# EAGLE design MRCS-Morse-Code-Buzzer-Controller (EAGLE 7.7.0)
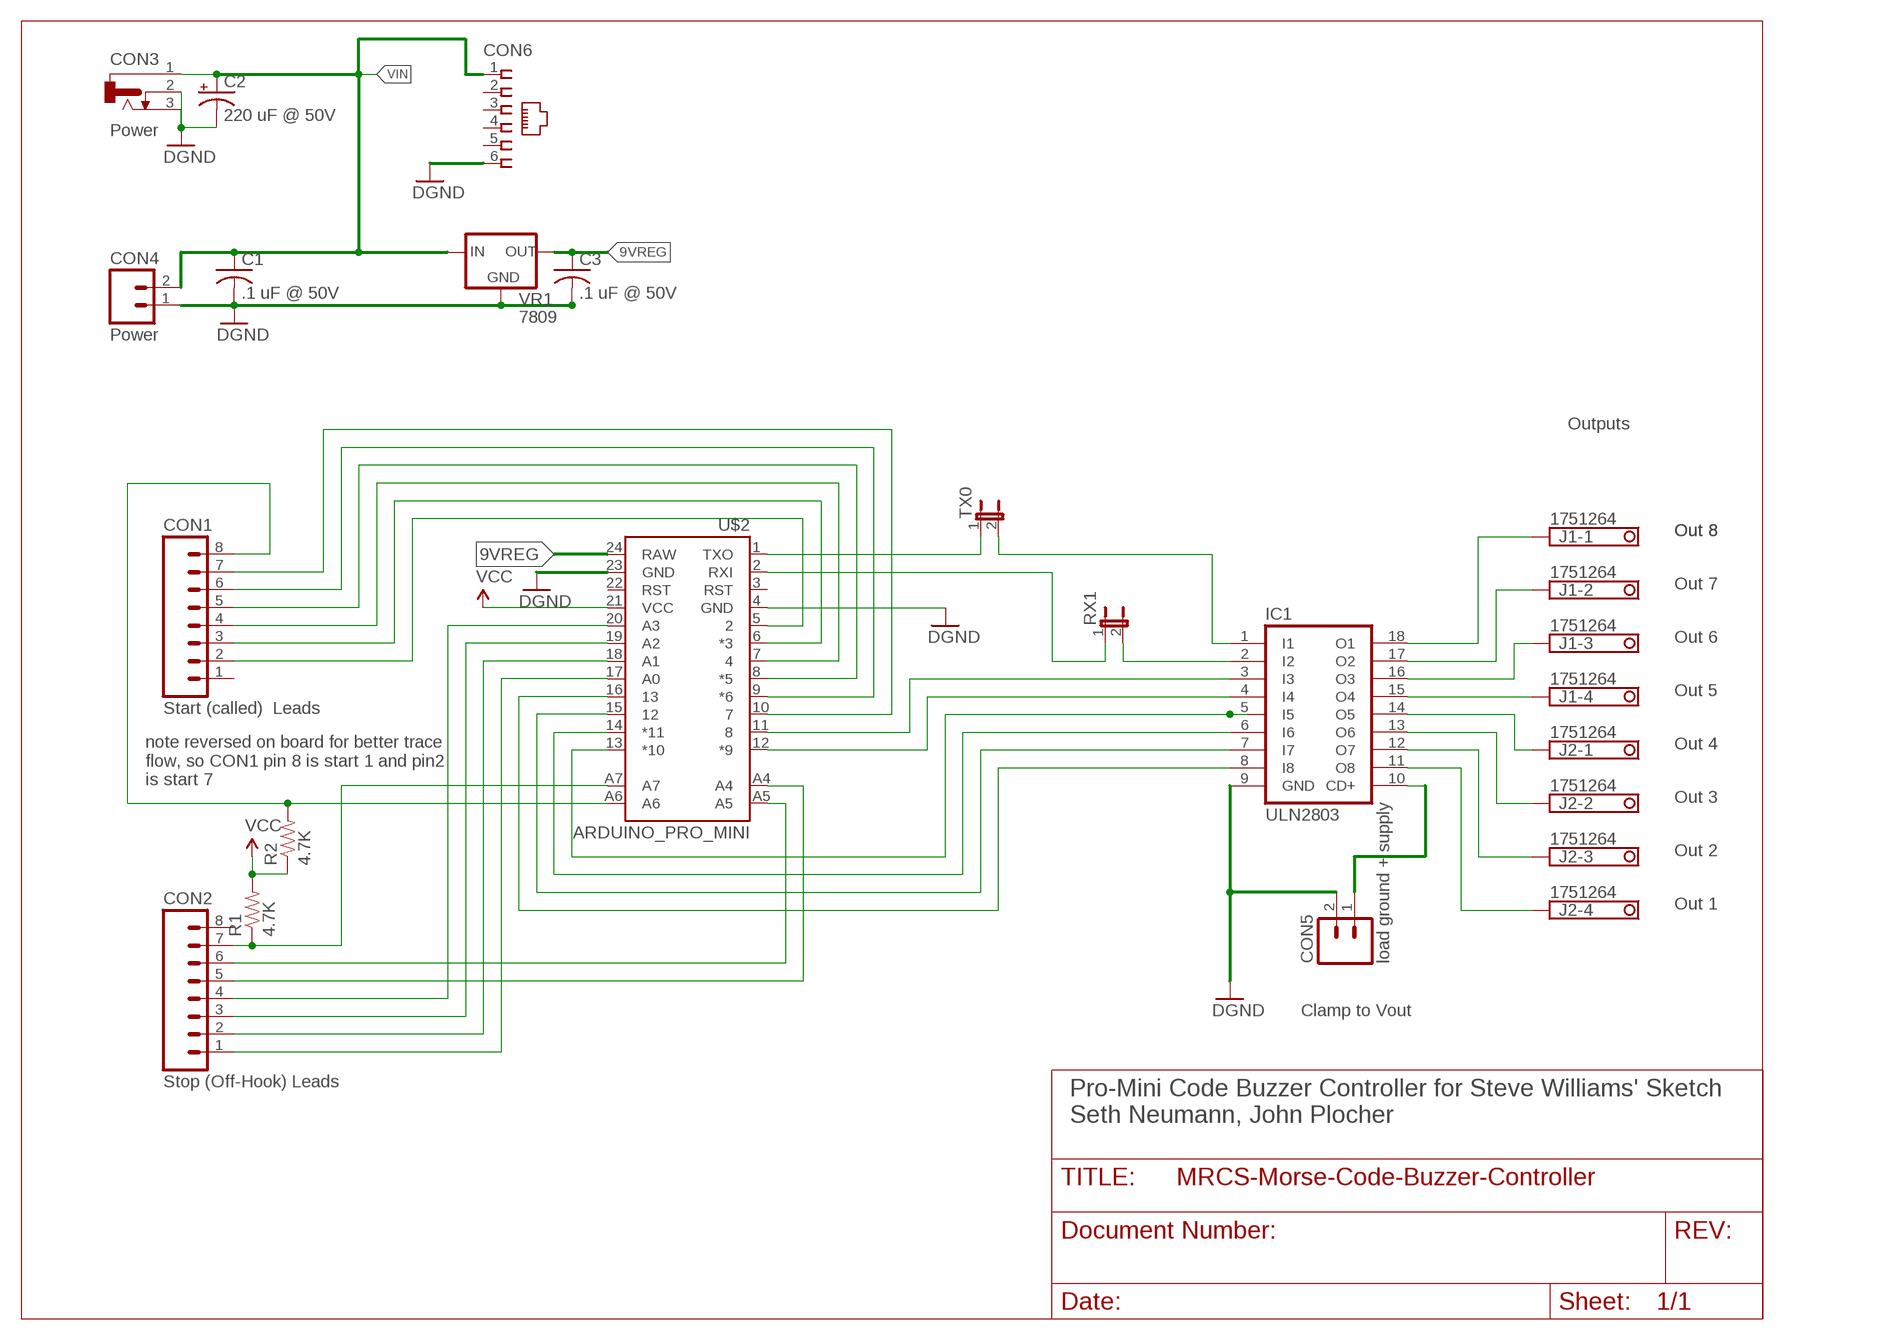
[diagram p0: schematic, sheet 1]

## Parts
C1  .1 uF @ 50V  C-US025-030X050  [C025-030X050]
C2  220 uF @ 50V  CPOL-USE3.5-10  [E3,5-10]
C3  .1 uF @ 50V  C-US025-030X050  [C025-030X050]
CON1  Start (called) Leads  CONNECTOR-M08LOCK  [1X08_LOCK]
CON2  Stop (Off-Hook) Leads  CONNECTOR-M08LOCK  [1X08_LOCK]
CON3  Power  CONNECTOR-DC-POWER-RA  [DCJ0202]
CON4  Power  CONNECTOR-M02508-LOCK  [MSTB2]
CON5  load ground + supply  CONNECTOR-M02508-LOCK  [MSTB2]
CON6  CONNECTOR-RJ25-43860-2-MOLEX  [RJ25-INVERTED]
IC1  ULN2803  ULN2803A  [DIL18]
J1  1751264  [1751264]
J2  1751264  [1751264]
R1  4.7K  RPTH04  [AXIAL-0.4-RES]
R2  4.7K  RPTH04  [AXIAL-0.4-RES]
RX1  JUMPER-2PTH  [1X02]
TX0  JUMPER-2PTH  [1X02]
U$2  ARDUINO_PRO_MINI  [ARDUINO_PRO_MINI]
VR1  7809  VREG-PTH-RA-9  [TO-220-RA-SINK]

## Nets
9VREG: C3.1 U$2.24(RAW) VR1.OUT
GND [power]: C1.2 C2.- C3.2 CON3.2 CON3.3 CON4.1 CON5.2 CON6.6 IC1.9(GND) U$2.4(GND) U$2.23(GND) VR1.GND ; supply symbol labelled DGND
N$1 [power]: IC1.18(O1) J1.1
N$2 [power]: IC1.17(O2) J1.2
N$3 [power]: IC1.16(O3) J1.3
N$4 [power]: IC1.15(O4) J1.4
N$5 [power]: IC1.14(O5) J2.1
N$6 [power]: IC1.13(O6) J2.2
N$7 [power]: IC1.12(O7) J2.3
N$8 [power]: IC1.11(O8) J2.4
N$9 [inputs]: CON1.2 U$2.5
N$10 [inputs]: CON1.3 U$2.6(*3)
N$11 [inputs]: CON1.4 U$2.7
N$12 [inputs]: CON1.5 U$2.8(*5)
N$13 [inputs]: CON1.6 U$2.9(*6)
N$14 [inputs]: CON1.7 U$2.10
N$15 [inputs]: CON1.8 R2.P$2 U$2.A6
N$16 [inputs]: CON2.7 R1.P$1 U$2.A7
N$17 [inputs]: CON2.1 U$2.17(A0)
N$18: IC1.3(I3) U$2.11
N$19: IC1.4(I4) U$2.12(*9)
N$20: IC1.8(I8) U$2.16
N$21: IC1.5(I5) U$2.13(*10)
N$22: IC1.6(I6) U$2.14(*11)
N$23: IC1.7(I7) U$2.15
N$24 [inputs]: CON2.2 U$2.18(A1)
N$25 [inputs]: CON2.3 U$2.19(A2)
N$26 [inputs]: CON2.4 U$2.20(A3)
N$27 [inputs]: CON2.5 U$2.A4
N$28 [inputs]: CON2.6 U$2.A5
N$29: TX0.1 U$2.1(TXO)
N$30: IC1.1(I1) TX0.2
N$32: IC1.2(I2) RX1.2
N$35 [power]: CON5.1 IC1.10(CD+)
N$40: RX1.1 U$2.2(RXI)
VCC [power]: R1.P$2 R2.P$1 U$2.21(VCC)
VIN: C1.1 C2.+ CON3.1 CON4.2 CON6.1 VR1.IN
Unconnected: CON1.1 CON2.8 CON6.2 CON6.3 CON6.4 CON6.5 U$2.3(RST) U$2.22(RST)

## Notes on the sheet
- Outputs
- Out 8 | Out 8
- Out 7
- Out 6
- Out 5
- Out 4
- note reversed on board for better trace
  flow, so CON1 pin 8 is start 1 and pin2 
  is start 7
- Out 3
- Out 2
- Out 1
- Clamp to Vout
- Pro-Mini Code Buzzer Controller for Steve Williams' Sketch
  Seth Neumann, John Plocher

## Library data of the parts
C1 C3 = rcl:C-US: CAPACITOR, American symbol
C2 = rcl:CPOL-US: POLARIZED CAPACITOR, American symbol
CON1 CON2 = SPCoast:CONNECTOR-M08: Header 8 Standard 8-pin 0.1" header. Use with straight break away headers (SKU : PRT-00116), right angle break away headers (PRT-00553), swiss pins (PRT-00743), machine pins (PRT-00117), and female headers (PRT-00115).
CON3 = SPCoast 2017_04:CONNECTOR-DC-POWER: DC POWER JACK Source: DCJ0202.pdf
CON4 CON5 = SPCoast 2017_04:CONNECTOR-M02: PHOENIX CONNECTOR
CON6 = SPCoast:CONNECTOR-RJ25: AMP connector
IC1 = uln-udn:ULN2803A: DRIVER ARRAY
J1 J2 = mschutzer:1751264: MKDS 1/ 4-3,5 Printklemme Nennstrom: 10 A Bemessungsspannung: 160 V Raster: 3,5 mm Polzahl: 4 Montageart: Löten Anschlussart: Schraubanschluss Anschlussrichtung vom Leiter zur Platine: 0° Source: http://eshop.phoenixcontact.com .. 1751264.pdf; MPN: 1751264; OC_FARNELL: unknown; OC_NEWARK: 10R0934
R1 R2 = SPCoast 2017_04:R*: Resistor Basic schematic elements and footprints for 0603, 1206, and PTH 1/10th watt (small) resistors.
RX1 TX0 = SPCoast 2017_04:JUMPER-2: Jumper Basic 0.1" spaced jumper. Use with breakaway headers.
U$2 = SparkFun-Boards-modified:ARDUINO_PRO_MINI
VR1 = SPCoast:VREG-?-*: Voltage Regulator Standard linear regulator. 7805 uses IGO pinout LM1117 uses GOI pinout

## Net classes
0 default: width 0.305 mm
1 power: width 0.61 mm
2 inputs: width 0.203 mm

## Board
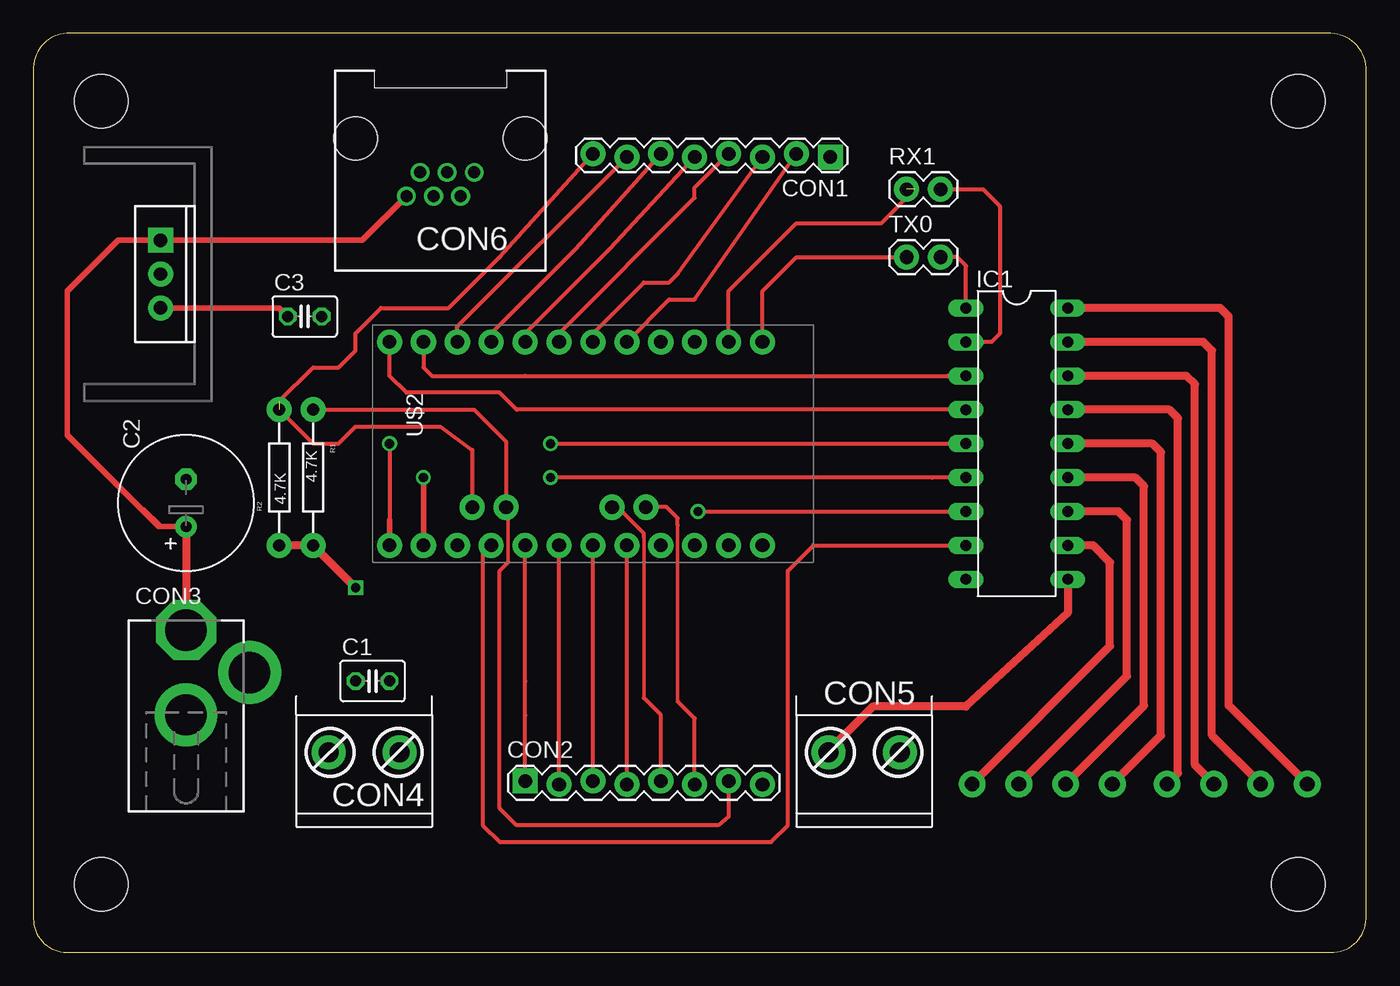
[diagram p1: board, top side]
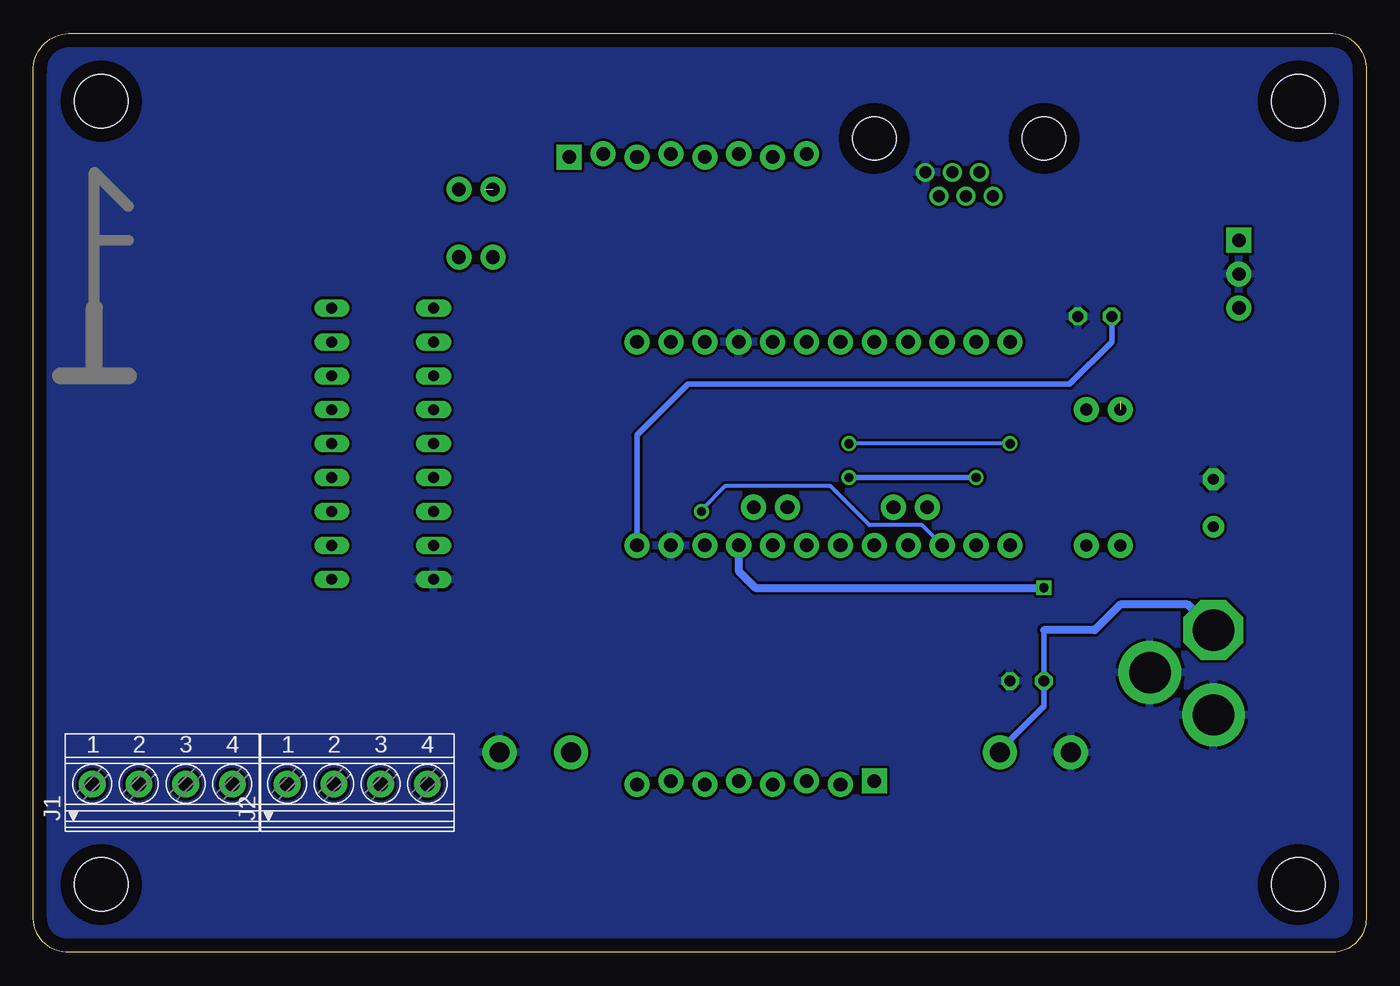
[diagram p2: board, bottom side, seen from below]

Size 99.82 x 68.83 mm. Coordinates in mm from the lower left corner, seen from the top.
Copper layers (1*16): Top 0.035mm / dielectric 1.5mm / Bottom 0.035mm
Design rules "default": minimum track width 10mil, minimum drill 24mil, track to track 8mil, track to pad 8mil, pad to pad 8mil, via to via 8mil, smd to smd 8mil, copper to edge 40mil, drill to drill 8mil, minimum pad ring 10mil, minimum via ring 8mil, stop-mask expansion 4mil, vias tented up to drill 0mil, thermal gap 10mil
tKeepout: area 58.4,29.2 to 64.8,47

### Footprints (pad centres in the part's own frame; a part is rotated, then mirrored left to right if it is on the bottom)
C025-030X050 = drill 0.813 octagon: 1 -1.27,0; 2 1.27,0
E3,5-10 = drill 0.813 pad 1.6: + -1.778,0 | drill 0.813 pad 1.6 octagon: - 1.778,0
1X08_LOCK = drill 1.016 pad 1.88 square: 1 0,0.127 | drill 1.016 pad 1.88: 2 2.54,-0.127; 3 5.08,0.127; 4 7.62,-0.127; 5 10.16,0.127; 6 12.7,-0.127; 7 15.24,0.127; 8 17.78,-0.127
DCJ0202 = drill 3.1 pad 4.5 octagon: 1 0,3.175 | drill 3.1 pad 4.7: 2 4.763,0; 3 0,-3.175
MSTB2 = drill 1.5 pad 2.54: 1 -2.667,1.016; 2 2.667,1.016
RJ25-INVERTED = drill 0.9 pad 1.4: 1 2.54,4.318; 2 1.524,2.54; 3 0.508,4.318; 4 -0.508,2.54; 5 -1.524,4.318; 6 -2.54,2.54 | hole 3.251: -6.35,0; 6.35,0
DIL18 = drill 0.813 long: 1 -10.16,-3.81; 2 -7.62,-3.81; 3 -5.08,-3.81; 4 -2.54,-3.81; 5 0,-3.81; 6 2.54,-3.81; 7 5.08,-3.81; 8 7.62,-3.81; 9 10.16,-3.81; 10 10.16,3.81; 11 7.62,3.81; 12 5.08,3.81; 13 2.54,3.81; 14 0,3.81; 15 -2.54,3.81; 16 -5.08,3.81; 17 -7.62,3.81; 18 -10.16,3.81
1751264 = drill 1.1 pad 2: 1 -5.25,-0.1; 2 -1.75,-0.1; 3 1.75,-0.1; 4 5.25,-0.1
AXIAL-0.4-RES = drill 0.9 pad 1.88: P$1 -5.08,0; P$2 5.08,0
1X02 = drill 1.016 pad 1.88: 1 0,0; 2 2.54,0
BOARD-DINRAIL-2.71IN-MRCS = hole 4: 94.742,5.08; 5.08,63.754; 94.742,63.754; 5.08,5.08
ARDUINO_PRO_MINI = drill 1.016 pad 1.88: 1 -7.62,12.7; 2 -7.62,10.16; 3 -7.62,7.62; 4 -7.62,5.08; 5 -7.62,2.54; 6 -7.62,0; 7 -7.62,-2.54; 8 -7.62,-5.08; 9 -7.62,-7.62; 10 -7.62,-10.16; 11 -7.62,-12.7; 12 -7.62,-15.24; 13 7.62,-15.24; 14 7.62,-12.7; 15 7.62,-10.16; 16 7.62,-7.62; 17 7.62,-5.08; 18 7.62,-2.54; 19 7.62,0; 20 7.62,2.54; 21 7.62,5.08; 22 7.62,7.62; 23 7.62,10.16; 24 7.62,12.7; A4 4.763,1.429; A5 4.763,3.969; A6 4.763,-9.049; A7 4.763,-6.509
TO-220-RA-SINK = drill 1 pad 1.88: GND 0,0; OUT 2.54,0 | drill 1 pad 1.88 square: IN -2.54,0

### Placement (x,y rotation side)
C1  25.4,20.32 0 top
C2  11.43,33.66 90 top
C3  20.32,47.62 0 top
CON1  59.69,59.69 180 top
CON2  36.83,12.7 0 top
CON3  11.43,20.95 0 top
CON4  24.77,13.97 0 top
CON5  62.23,13.97 0 top
CON6  30.48,60.96 180 top
IC1  73.66,38.1 270 top
J1  90.17,12.7 0 bottom
J2  75.57,12.7 0 bottom
R1  20.96,35.56 270 top
R2  18.42,35.56 90 top
RX1  65.41,57.15 0 top
TX0  65.41,52.07 0 top
U$1  [BOARD-DINRAIL-2.71IN-MRCS]  0,0 0 top
U$2  41.91,38.1 270 top
U$3  [CA-PROP65WARNING]  39.37,6.35 180 top
VR1  9.53,50.8 270 top

### Tracks (layer width: path | path; a pad name or v marks a point on that pad's centre or on a via)
9VREG
  Top 0.406: VR1.OUT 18.42,48.26 C3.1
  Bottom 0.406: C3.1 19.05,45.72 22.23,42.55 50.8,42.55 54.61,38.73 U$2.24
GND
  pour Bottom: 0,68.58 100.33,68.58 100.33,0 0,0
N$1
  Top 0.61: J1.1 89.54,18.48 89.54,47.62 88.9,48.26 IC1.18
N$2
  Top 0.61: J1.2 88.27,16.25 88.27,45.08 87.63,45.72 IC1.17
N$3
  Top 0.61: J1.3 87,14.02 87,42.55 86.36,43.18 IC1.16
N$4
  Top 0.61: J1.4 85.73,13.41 85.73,40 85.09,40.64 IC1.15
N$5
  Top 0.61: J2.1 84.46,16.24 84.46,37.47 83.82,38.1 IC1.14
N$6
  Top 0.61: J2.2 83.19,18.47 83.19,34.92 82.55,35.56 IC1.13
N$7
  Top 0.61: J2.3 81.92,20.7 81.92,32.39 81.28,33.02 IC1.12
N$8
  Top 0.61: J2.4 80.65,22.93 80.65,29.21 79.38,30.48 IC1.11
N$9
  Top 0.305: CON1.2 49.53,48.89 47.63,48.89 U$2.5
N$10
  Top 0.305: U$2.6 41.91,46.36 45.72,50.17 47.63,50.17 48.26,50.8 CON1.3
N$11
  Top 0.305: U$2.7 39.37,46.36 49.53,56.52 49.53,57.28 CON1.4
N$12
  Top 0.305: U$2.8 36.83,46.36 43.18,52.7 CON1.5
N$13
  Top 0.305: U$2.9 34.29,46.36 40.64,52.7 CON1.6
N$14
  Top 0.305: U$2.10 31.75,46.86 CON1.7
N$15  (1 unrouted)
  Top 0.305: U$2.A6 32.86,37.62 30.48,39.37 24.13,39.37 22.86,38.1 20.96,38.1 R2.P$2 | 18.42,41.28 20.96,43.81 22.86,43.81 24.13,45.08 24.13,46.36 26.04,48.26 31.12,48.26 34.93,52.07 CON1.8
N$16
  Top 0.254: U$2.A7 35.56,33.18 35.56,29.21
  Top 0.305: R1.P$1 33.02,40.64 35.4,38.26 U$2.A7 | CON2.7 52.07,10.16 51.31,9.52 36.2,9.52 34.93,10.79 34.93,28.57 35.56,29.21
N$17
  Top 0.305: CON2.1 36.83,17.78 36.83,20.32 U$2.17
N$18
  Top 0.305: U$2.11 29.21,43.81 29.85,43.18 36.83,43.18 68.58,43.18
  Top 0.406: IC1.3 68.58,43.18
N$19
  Top 0.305: IC1.4 36.2,40.64 34.93,41.91 27.94,41.91 26.67,43.18 U$2.12
N$20
  Top 0.305: U$2.16 33.66,29.85 33.66,9.52 34.93,8.25 55.25,8.25 56.52,9.52 56.52,22.22 56.52,28.57 58.42,30.48 IC1.8
N$21  (via drill 0.7)
  Top 0.305: v38.74,38.1 IC1.5 | v26.67,38.1 26.67,32.39
  Top 0.406: 26.67,32.39 U$2.13
  Bottom 0.305: v26.67,38.1 v38.74,38.1
N$22  (via drill 0.7)
  Top 0.305: IC1.6 67.31,35.56 v38.74,35.56
  Top 0.406: v29.21,35.56 U$2.14
  Bottom 0.406: v38.74,35.56 30.48,35.56 v29.21,35.56
N$23  (via drill 0.7)
  Top 0.305: v49.79,33.02 IC1.7
  Bottom 0.305: U$2.15 33.28,32 37.21,32 40.13,34.92 48.01,34.92 49.79,33.15 v49.79,33.02
N$24
  Top 0.305: CON2.2 39.37,17.78 39.37,20.32 U$2.18
N$25
  Top 0.305: CON2.3 41.91,17.78 41.91,20.32 U$2.19
N$26
  Top 0.305: CON2.4 44.45,17.78 44.45,20.32 U$2.20
N$27
  Top 0.254: 45.72,19.05 45.72,31.11
  Top 0.305: CON2.5 46.99,17.78 45.72,19.05 | 45.72,31.11 45.72,31.37 43.75,33.34 U$2.A4
N$28
  Top 0.254: 48.26,18.8 48.26,32
  Top 0.305: CON2.6 49.53,17.53 48.26,18.8 | 48.26,32 48.26,32.51 47.44,33.34 U$2.A5
N$29
  Top 0.305: U$2.1 54.61,49.53 57.15,52.07 TX0.1
N$30
  Top 0.305: IC1.1 69.85,51.44 69.22,52.07 TX0.2
N$32
  Top 0.305: RX1.2 71.12,57.15 72.39,55.88 72.39,46.36 71.76,45.72 IC1.2
N$35
  Top 0.61: IC1.10 77.47,25.4 69.85,18.41 62.87,18.41 59.69,15.24 59.69,15.11 CON5.1
N$40  (1 unrouted)
  Top 0.305: U$2.2 52.07,49.53 57.15,54.61 63.5,54.61 66.04,57.15
VCC  (via drill 0.7)
  Top 0.61: R2.P$1 R1.P$2 v24.13,27.31
  Bottom 0.61: U$2.21 46.99,28.57 45.72,27.31 v24.13,27.31
VIN
  Top 0.406: C2.+ 9.53,31.88 | 9.53,31.88 9.4,31.88 2.54,38.73 2.54,49.53 6.35,53.34 VR1.IN 24.64,53.34 CON6.1 | 8.26,33.15 9.53,31.88
  Top 0.61: C2.+ CON3.1
  Bottom 0.406: 24.13,24.13 C1.1 24.13,18.41 27.43,15.11 CON4.2
  Bottom 0.61: CON3.1 13.34,26.04 18.42,26.04 20.32,24.13 24.13,24.13

### Text on the board
tDocu: 1 Start 7 | MORSE CODE / BUZZER CONTROLLER | Ver 5.0 20200930 / Seth Neumann / John Plocher | FTDI header | Clamp | GND Vin | 1 Stop 7 | Vload GND | 1 Output | 10-24 / VDC